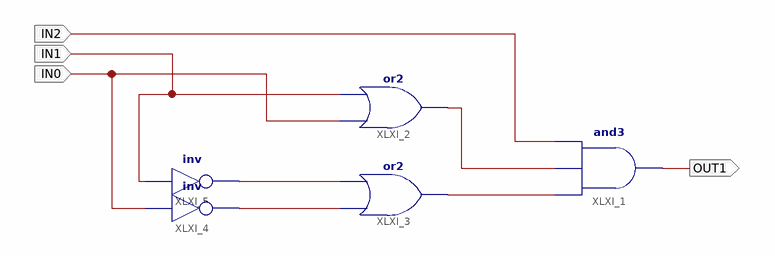
[diagram p0: schematic sheet 1]
// Xilinx ISE schematic Segmento1.sch (spartan3e) as structural Verilog: 5 symbols, 4 ports
module Segmento1 (
  input  IN2,
  input  IN0,
  input  IN1,
  output OUT1
);

  wire XLXN_14, XLXN_15, XLXN_20, XLXN_28;

  and XLXI_1 (OUT1, XLXN_15, XLXN_14, IN2);
  or XLXI_2 (XLXN_14, IN0, IN1);
  or XLXI_3 (XLXN_15, XLXN_20, XLXN_28);
  not XLXI_4 (XLXN_20, IN0);
  not XLXI_5 (XLXN_28, IN1);
endmodule
